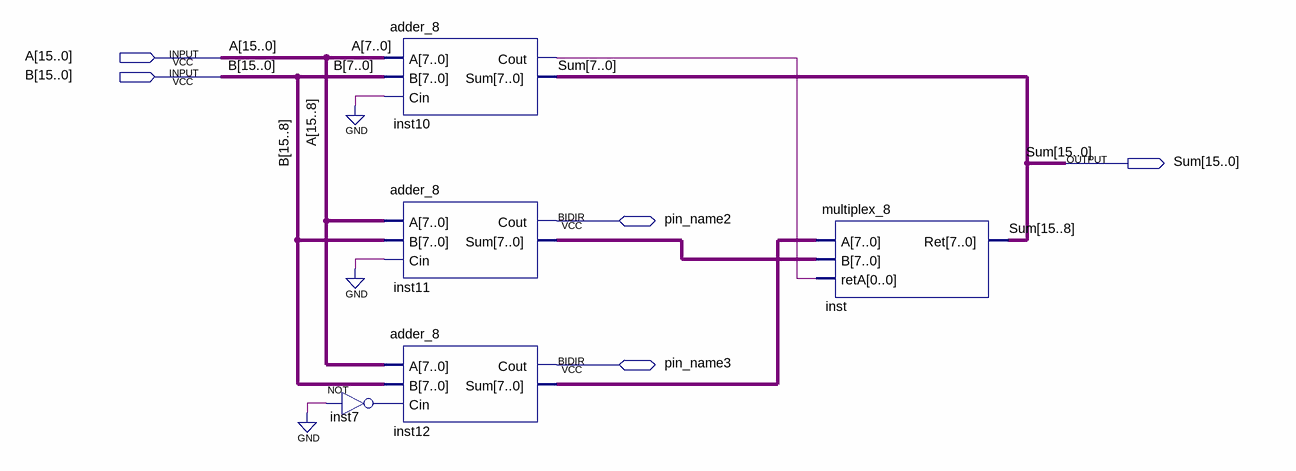
[diagram p0: schematic sheet]
// Quartus schematic adder_16_fast.bdf as structural Verilog: 5 symbols, 5 pins
module adder_16_fast (
  input  [15:0] A,
  input  [15:0] B,
  inout  pin_name2,
  inout  pin_name3,
  output [15:0] Sum
);

  wire inst7_out, inst10_cout;
  wire [7:0] inst11_sum, inst12_sum;

  adder_8 inst10 (.A(A[7:0]), .B(B[7:0]), .Cin(1'b0), .Cout(inst10_cout), .Sum(Sum[7:0]));
  adder_8 inst11 (.A(A[15:8]), .B(B[15:8]), .Cin(1'b0), .Cout(pin_name2), .Sum(inst11_sum));
  adder_8 inst12 (.A(A[15:8]), .B(B[15:8]), .Cin(inst7_out), .Cout(pin_name3), .Sum(inst12_sum));
  not inst7 (inst7_out, 1'b0);
  multiplex_8 inst (.A(inst12_sum), .B(inst11_sum), .retA(inst10_cout), .Ret(Sum[15:8]));
endmodule
